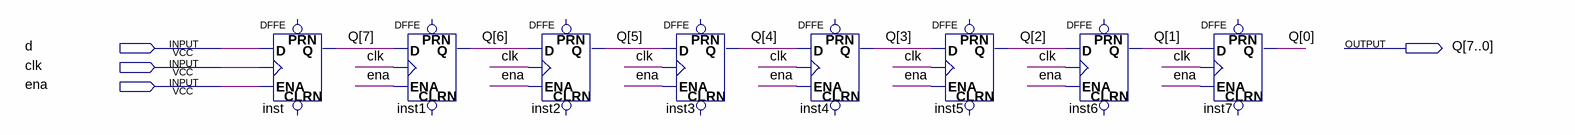
[diagram p0: schematic sheet]
// Quartus schematic sipo8.bdf as structural Verilog: 8 symbols, 4 pins
module sipo8 (
  input  d,
  input  clk,
  input  ena,
  output [7:0] Q
);

  DFFE inst (.D(d), .CLK(clk), .ENA(ena), .Q(Q[7]));  // open: PRN, CLRN
  DFFE inst1 (.D(Q[7]), .CLK(clk), .ENA(ena), .Q(Q[6]));  // open: PRN, CLRN
  DFFE inst2 (.D(Q[6]), .CLK(clk), .ENA(ena), .Q(Q[5]));  // open: PRN, CLRN
  DFFE inst3 (.D(Q[5]), .CLK(clk), .ENA(ena), .Q(Q[4]));  // open: PRN, CLRN
  DFFE inst4 (.D(Q[4]), .CLK(clk), .ENA(ena), .Q(Q[3]));  // open: PRN, CLRN
  DFFE inst5 (.D(Q[3]), .CLK(clk), .ENA(ena), .Q(Q[2]));  // open: PRN, CLRN
  DFFE inst6 (.D(Q[2]), .CLK(clk), .ENA(ena), .Q(Q[1]));  // open: PRN, CLRN
  DFFE inst7 (.D(Q[1]), .CLK(clk), .ENA(ena), .Q(Q[0]));  // open: PRN, CLRN
endmodule
